# Altium schematic sheet wristband4.SchDoc
size A
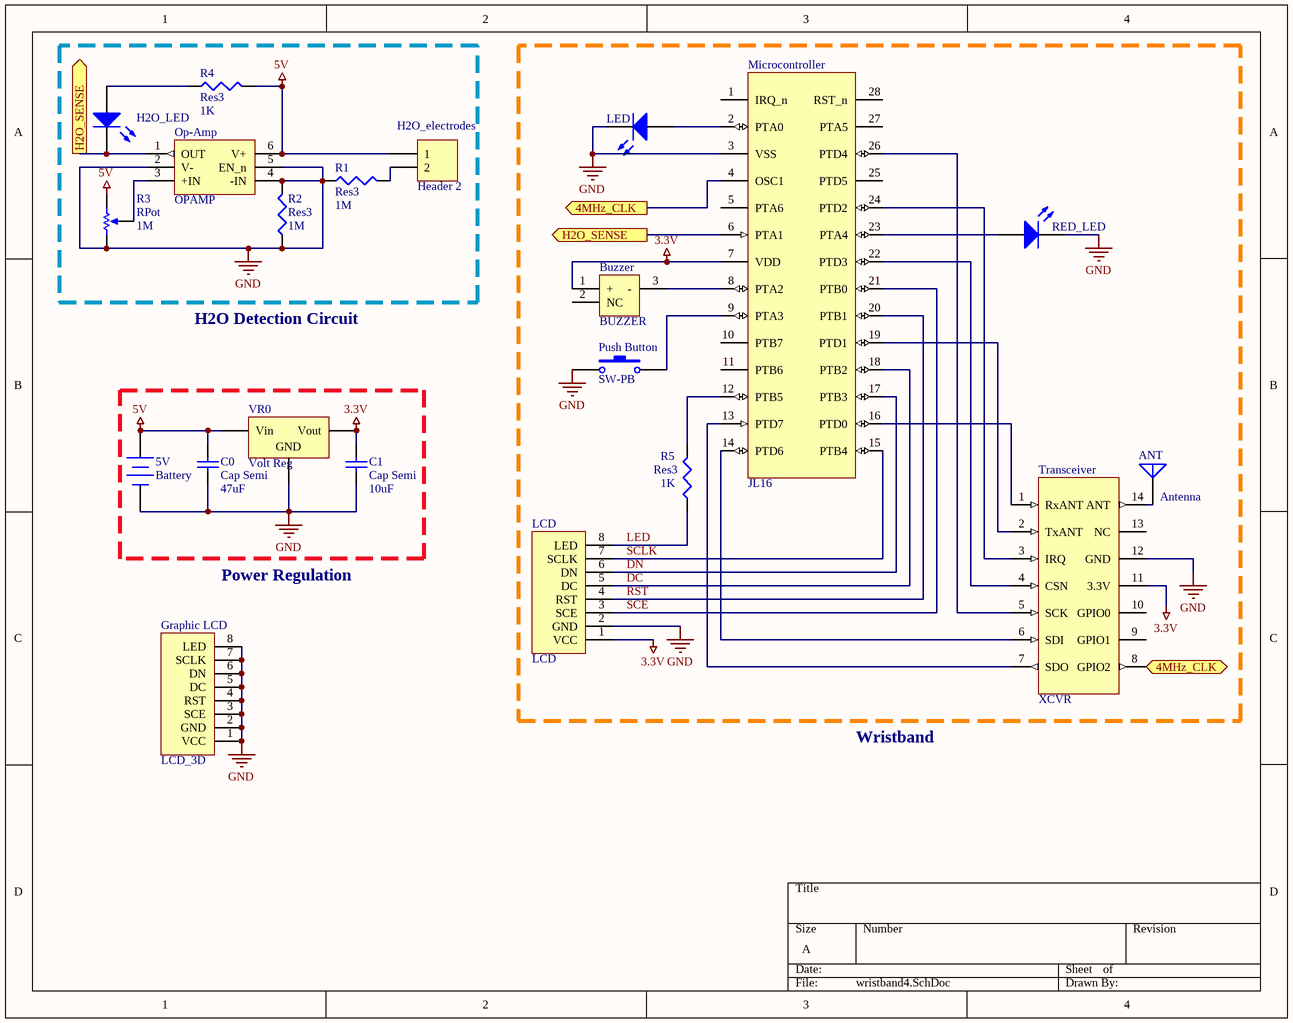
[diagram p0: wristband4.SchDoc]

## Parts
5V  Battery  [BAT-2]
ANT  Antenna  [PIN1]
Buzzer  BUZZER  [BUZZER_SOJ]
C0  Cap Semi  value 47uF  [1310[0504]]
C1  Cap Semi  value 10uF  [1310[0504]]
Graphic_LCD  LCD_3D  [LCD]
H2O_electrodes  Header 2  [HDR1X2]
H2O_LED  LED2  [3.2X1.6X1.1]  (value not drawn)
LCD  LCD  [HEADER1X8]
LED  LED2  [3.2X1.6X1.1]  (value not drawn)
Microcontroller  JL16  [JL16_QUAD32]
Op-Amp  OPAMP  [OPAMP_SOP6]
Push_Button  SW-PB  [SPST-2]
R1  Res3  value 1M  [J1-0603]
R2  Res3  value 1M  [J1-0603]
R3  RPot  value 1M  [VR5]
R4  Res3  value 1K  [J1-0603]
R5  Res3  value 1K  [J1-0603]
RED_LED  LED2  [3.2X1.6X1.1]  (value not drawn)
Transceiver  XCVR  [XCVR_SOP16]
VR0  Volt Reg  [VREG_SOT]

## Ports
4MHz_CLK (out), H2O_SENSE (out)

## Nets
3.3V: Buzzer.1(+) C1.2 LCD.1(VCC) Microcontroller.7(VDD) Transceiver.11(3.3V) VR0.3(Vout)
5V: 5V.1(+) C0.2 H2O_electrodes.1 Op-Amp.6(V+) R3.2(BOT) R4.2 VR0.1(Vin)
GND: 5V.2(-) C0.1 C1.1 Graphic_LCD.1(VCC) Graphic_LCD.2(GND) Graphic_LCD.3(SCE) Graphic_LCD.4(RST) Graphic_LCD.5(DC) Graphic_LCD.6(DN) Graphic_LCD.7(SCLK) Graphic_LCD.8(LED) LCD.2(GND) LED.2(K) Microcontroller.3(VSS) Op-Amp.2(V-) Op-Amp.4(-IN) Op-Amp.5(EN_n) Push_Button.1 R1.1 R2.1 R2.2 R3.1(TOP) RED_LED.2(K) Transceiver.12(GND) VR0.2(GND)
4MHz_CLK: Microcontroller.4(OSC1) Transceiver.8(GPIO2) ; port 4MHz_CLK
DC: LCD.5(DC) Microcontroller.18(PTB2)
DN: LCD.6(DN) Microcontroller.17(PTB3)
H2O_SENSE: H2O_LED.2(K) Microcontroller.6(PTA1) Op-Amp.1(OUT) ; port H2O_SENSE
LED: LCD.8(LED) R5.1
RST: LCD.4(RST) Microcontroller.20(PTB1)
SCE: LCD.3(SCE) Microcontroller.21(PTB0)
SCLK: LCD.7(SCLK) Microcontroller.15(PTB4)
NetANT_1: ANT.1(A) Transceiver.14(ANT)
NetBuzzer_3: Buzzer.3(-) Microcontroller.8(PTA2)
NetH2O_electrodes_2: H2O_electrodes.2 R1.2
NetH2O_LED_1: H2O_LED.1(A) R4.1
NetLED_1: LED.1(A) Microcontroller.2(PTA0)
NetMicrocontroller_9: Microcontroller.9(PTA3) Push_Button.2
NetMicrocontroller_12: Microcontroller.12(PTB5) R5.2
NetMicrocontroller_13: Microcontroller.13(PTD7) Transceiver.7(SDO)
NetMicrocontroller_14: Microcontroller.14(PTD6) Transceiver.6(SDI)
NetMicrocontroller_16: Microcontroller.16(PTD0) Transceiver.1(RxANT)
NetMicrocontroller_19: Microcontroller.19(PTD1) Transceiver.2(TxANT)
NetMicrocontroller_22: Microcontroller.22(PTD3) Transceiver.4(CSN)
NetMicrocontroller_23: Microcontroller.23(PTA4) RED_LED.1(A)
NetMicrocontroller_24: Microcontroller.24(PTD2) Transceiver.3(IRQ)
NetMicrocontroller_26: Microcontroller.26(PTD4) Transceiver.5(SCK)
NetOp-Amp_3: Op-Amp.3(+IN) R3.3(TAP)

Not connected (* = marked no-connect by the designer): Buzzer 2(NC); Microcontroller 1(IRQ_n) 5(PTA6) 10(PTB7) 11(PTB6) 25(PTD5) 27(PTA5) 28(RST_n); Transceiver 9(GPIO1) 10(GPIO0) 13(NC)

## Notes on the sheet
- H2O Detection Circuit
- Power Regulation
- Wristband

## Library data of the parts
5V = Battery: Multicell Battery; Published: 24-Mar-1999; LatestRevisionDate: 17-Jul-2002; LatestRevisionNote: Re-released for DXP Platform.; PackageReference: BAT-2; Publisher: Altium Limited
ANT = Antenna: Generic Antenna; Published: 24-Mar-1999; LatestRevisionDate: 17-Jul-2002; LatestRevisionNote: Re-released for DXP Platform.; PackageReference: PIN1; Publisher: Altium Limited
C0 C1 = Cap Semi: Capacitor (Semiconductor SIM Model); Published: 8-Jun-2000; LatestRevisionDate: 17-Jul-2002; LatestRevisionNote: Re-released for DXP Platform.; PackageReference: C1206; Publisher: Altium Limited
H2O_electrodes = Header 2: Header, 2-Pin; LatestRevisionDate: 17-Jul-2002; LatestRevisionNote: Re-released for DXP Platform.; Publisher: Altium Limited
H2O_LED LED RED_LED = LED2: Typical RED, GREEN, YELLOW, AMBER GaAs LED; Published: 8-Jun-2000; LatestRevisionDate: 17-Jul-2002; LatestRevisionNote: Re-released for DXP Platform.; PackageDocument: Feb-2002; PackageReference: 3.2X1.6X1.1; Publisher: Altium Limited
Microcontroller = JL16: Freescale MC908JL16
Op-Amp = OPAMP: LT6230CS6
Push_Button = SW-PB: Switch; Published: 24-Mar-1999; LatestRevisionDate: 17-Jul-2002; LatestRevisionNote: Re-released for DXP Platform.; PackageReference: SPST-2; Publisher: Altium Limited
R1 R2 R4 R5 = Res3: Resistor; Published: 8-Jun-2000; LatestRevisionDate: 04-Mar-2005; LatestRevisionNote: PCB Footprint replaced.; PackageReference: J1-0603; Publisher: Altium Limited
R3 = RPot: Potentiometer; Sim Note: Enter the Resistance value and the set point into parameter fields.; Set Position: 0.5; Published: 8-Jun-2000; LatestRevisionDate: 17-Jul-2002; LatestRevisionNote: Re-released for DXP Platform.; PackageReference: VR5; Publisher: Altium Limited
Transceiver = XCVR: RFM22B
VR0 = Volt Reg: Voltage Regulator; Published: 24-Mar-1999; LatestRevisionDate: 17-Jul-2002; LatestRevisionNote: Re-released for DXP Platform.; PackageReference: D2PAK; Publisher: Altium Limited; Code_JEDEC: SMD-220